# EAGLE design PCM2704_Test_v1 (EAGLE 6.4)
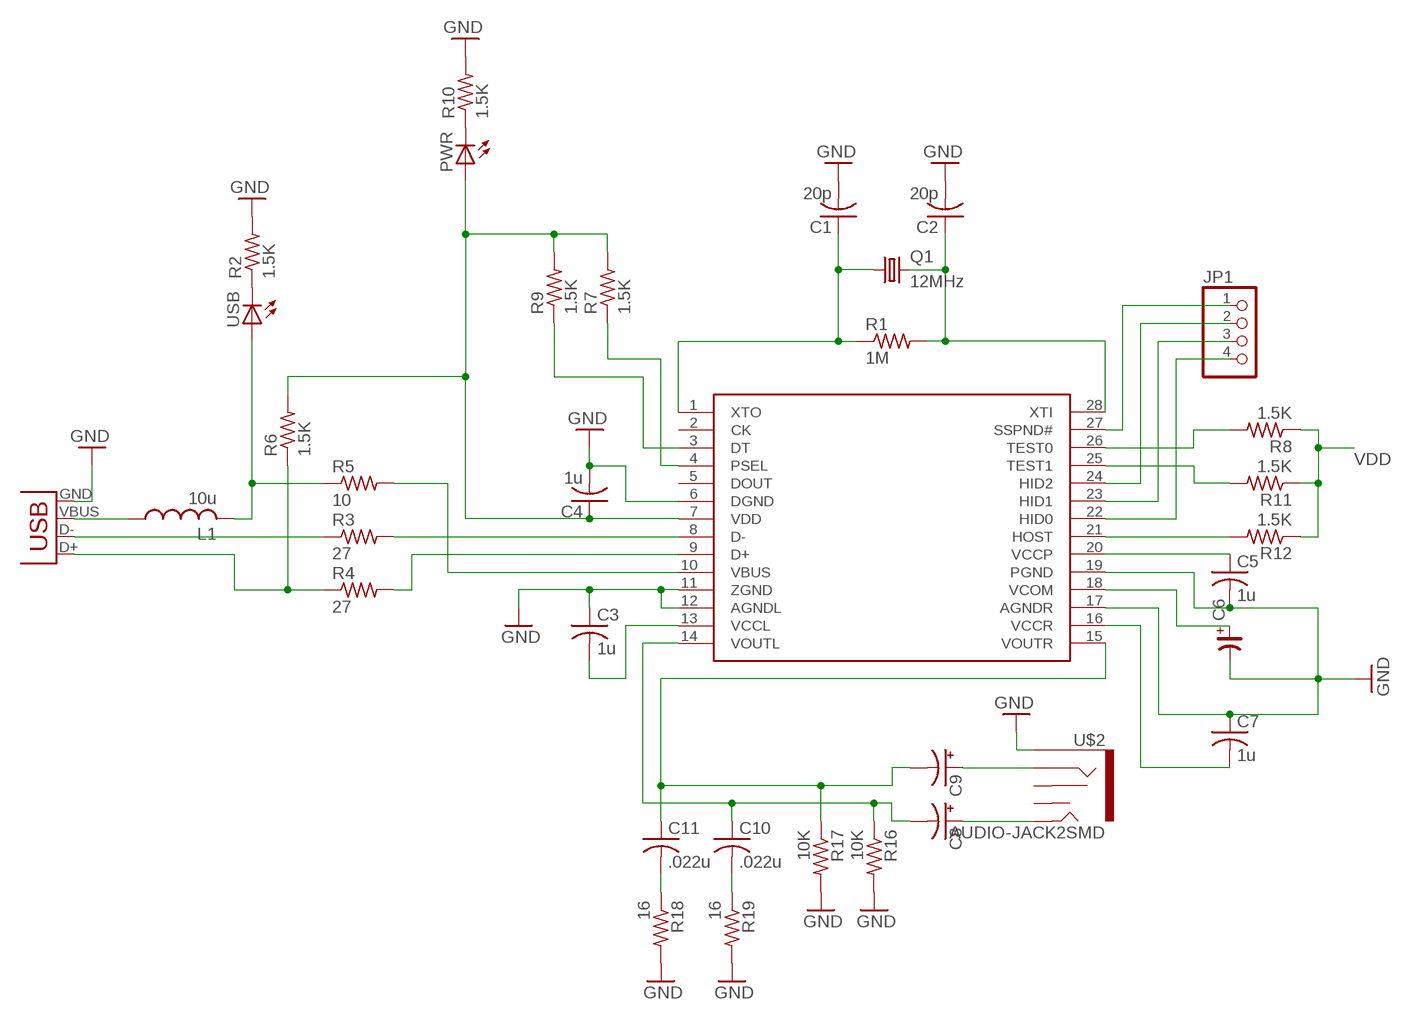
[diagram p0: schematic, sheet 1]

## Parts
C1  20p  C-USC0603  [C0603]
C2  20p  C-USC0603  [C0603]
C3  1u  C-USC0603  [C0603]
C4  1u  C-USC0603  [C0603]
C5  1u  C-USC0603  [C0603]
C6  CP_E-010X030  [CE-010X030]
C7  1u  C-USC0603  [C0603]
C8  CPOL-USE1.8-4  [E1,8-4]
C9  CPOL-USE1.8-4  [E1,8-4]
C10  .022u  C-USC0603  [C0603]
C11  .022u  C-USC0603  [C0603]
JP1  PINHD-1X4  [1X04]
L1  10u  L-USL3225M  [L3225M]
PWR  LEDCHIP-LED0603  [CHIP-LED0603]
Q1  12MHz  CRYSTALHC49US  [HC49US]
R1  1M  R-US_R0603  [R0603]
R2  1.5K  R-US_R0603  [R0603]
R3  27  R-US_R0603  [R0603]
R4  27  R-US_R0603  [R0603]
R5  10  R-US_R0603  [R0603]
R6  1.5K  R-US_R0603  [R0603]
R7  1.5K  R-US_R0603  [R0603]
R8  1.5K  R-US_R0603  [R0603]
R9  1.5K  R-US_R0603  [R0603]
R10  1.5K  R-US_R0603  [R0603]
R11  1.5K  R-US_R0603  [R0603]
R12  1.5K  R-US_R0603  [R0603]
R16  10K  R-US_R0603  [R0603]
R17  10K  R-US_R0603  [R0603]
R18  16  R-US_R0603  [R0603]
R19  16  R-US_R0603  [R0603]
U$1  PCM2704C  [PCM2704C]
U$2  AUDIO-JACK2SMD  [AUDIO-JACK-3.5MM-SMD]
USB  LEDCHIP-LED0603  [CHIP-LED0603]
X1  USB-MB-S  [USB-MB-S]

## Nets
GND: C1.2 C2.2 C3.1 C4.2 C5.2 C6.- C7.1 R2.2 R10.2 R16.2 R17.2 R18.2 R19.2 U$1.6(DGND) U$1.11(ZGND) U$1.12(AGNDL) U$1.17(AGNDR) U$1.19(PGND) U$2.SLEEVE X1.GND
N$1: C1.1 Q1.1 R1.1 U$1.1(XTO)
N$2: C2.1 Q1.2 R1.2 U$1.28(XTI)
N$3: R3.2 U$1.8(D-)
N$4: C3.2 U$1.13(VCCL)
N$5: R8.2 U$1.26(TEST0)
N$6: R4.2 U$1.9(D+)
N$7: L1.2 R5.1 USB.A
N$8: R5.2 U$1.10(VBUS)
N$9: R11.2 U$1.25(TEST1)
N$10: C9.- C11.1 R17.1 U$1.15(VOUTR)
N$11: R12.2 U$1.21(HOST)
N$12: JP1.1 U$1.27(SSPND#)
N$13: C5.1 U$1.20(VCCP)
N$14: C6.+ U$1.18(VCOM)
N$16: R9.1 U$1.3(DT)
N$17: R2.1 USB.C
N$18: C8.+ U$2.TIP
N$19: JP1.2 U$1.24(HID2)
N$20: JP1.3 U$1.23(HID1)
N$21: JP1.4 U$1.22(HID0)
N$22: PWR.C R10.1
N$23: C7.2 U$1.16(VCCR)
N$24: C8.- C10.1 R16.1 U$1.14(VOUTL)
N$25: C9.+ U$2.RING
N$27: C11.2 R18.1
N$28: C10.2 R19.1
PSEL: R7.1 U$1.4(PSEL)
USB_D_N: R3.1 X1.D-
USB_D_P: R4.1 R6.1 X1.D+
VBUS_RAW: L1.1 X1.VBUS
VDD: C4.1 PWR.A R6.2 R7.2 R8.1 R9.2 R11.1 R12.1 U$1.7(VDD)
Unconnected: U$1.2(CK) U$1.5(DOUT) U$2.RSH U$2.TSH

## Library data of the parts
C1-C5 C7 C10 C11 = rcl:C-US: CAPACITOR, American symbol
C6 = rc-master:CP_: POLARIZED CAP
C8 C9 = rcl:CPOL-US: POLARIZED CAPACITOR, American symbol
JP1 = pinhead:PINHD-1X4: PIN HEADER
L1 = rcl:L-US: INDUCTOR, American symbol
PWR USB = adafruit:LED: LED OSRAM: - CHIPLED LG R971, LG N971, LY N971, LG Q971, LY Q971, LO R971, LY R971 LH N974, LH R974 LS Q976, LO Q976, LY Q976 LO Q996 - Hyper CHIPLED LW Q18S LB Q993, LB Q99A, LB R99A - SideLED LS A670, LO A670, LY A670, LG A670, LP A670 LB A673, LV A673, LT A673, LW A673 LH A674 LY A675 LS A676, LA A676, LO A676, LY A676, LW A676 LS A679, LY A679, LG A679 - Hyper Micro SIDELED® LS Y876, LA Y876, LO Y876, LY Y876 LT Y87S - SmartLED LW L88C, LW L88S LB L89C, LB L89S, LG L890 LS L89K, LO L89K, LY L89K LS L896, LA L896, LO L896, LY L896 - TOPLED LS T670, LO T670, LY T670, LG T670, LP T670 LSG T670, LSP T670, LSY T670, LOP T670, LYG T670 LG T671, LOG T671, LSG T671 LB T673, LV T673, LT T673, LW T673 LH T674 LS T676, LA T676, LO T676, LY T676, LB T676, LH T676, LSB T676, LW T676 LB T67C, LV T67C, LT T67C, LS T67K, LO T67K, LY T67K, LW E67C LS E67B, LA E67B, LO E67B, LY E67B, LB E67C, LV E67C, LT E67C LW T67C LS T679, LY T679, LG T679 LS T770, LO T770, LY T770, LG T770, LP T770 LB T773, LV T773, LT T773, LW T773 LH T774 LS E675, LA E675, LY E675, LS T675 LS T776, LA T776, LO T776, LY T776, LB T776 LHGB T686 LT T68C, LB T68C - Hyper Mini TOPLED® LB M676 - Mini TOPLED Santana® LG M470 LS M47K, LO M47K, LY M47K Source: http://www.osram.convergy.de/
Q1 = SparkFun-FreqCtrl:CRYSTAL: Various standard crystals. Proven footprints. Spark Fun Electronics SKU : COM-00534
R1-R12 R16-R19 = rcl:R-US_: RESISTOR, American symbol
U$1 = pcm2704c:PCM2704C
U$2 = SparkFun-Connectors:AUDIO-JACK2: Stereo audio jack with bypass switches. Used on LilyPad MP3 board. Production SKU: CONN-10353; PROD_ID: CONN-10353
X1 = con-usb:USB: USB Connectors

## Board
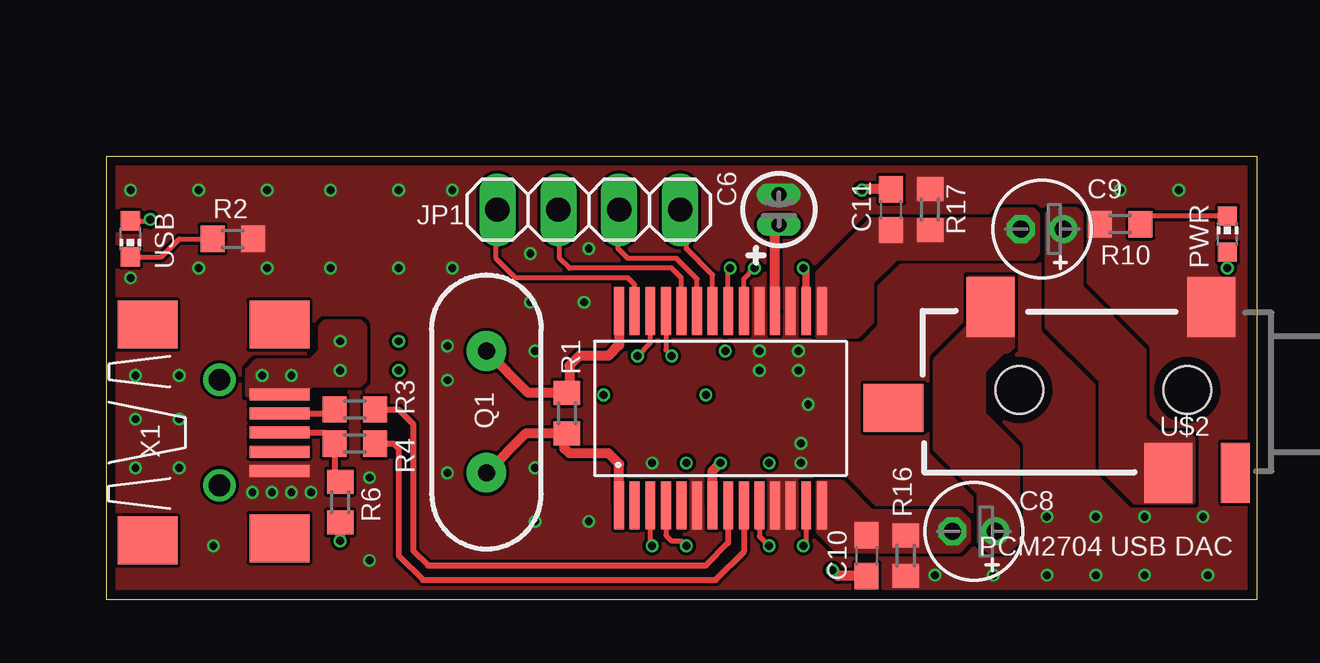
[diagram p1: board, top side]
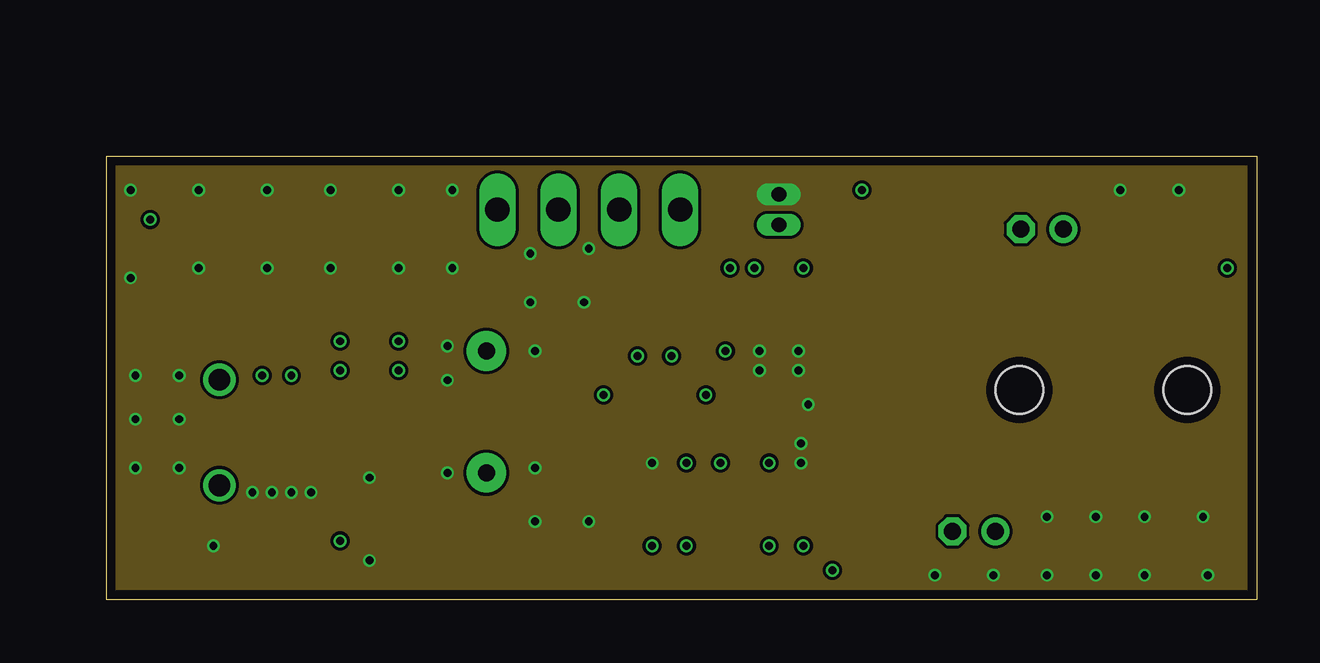
[diagram p2: board, inner layer Route2]
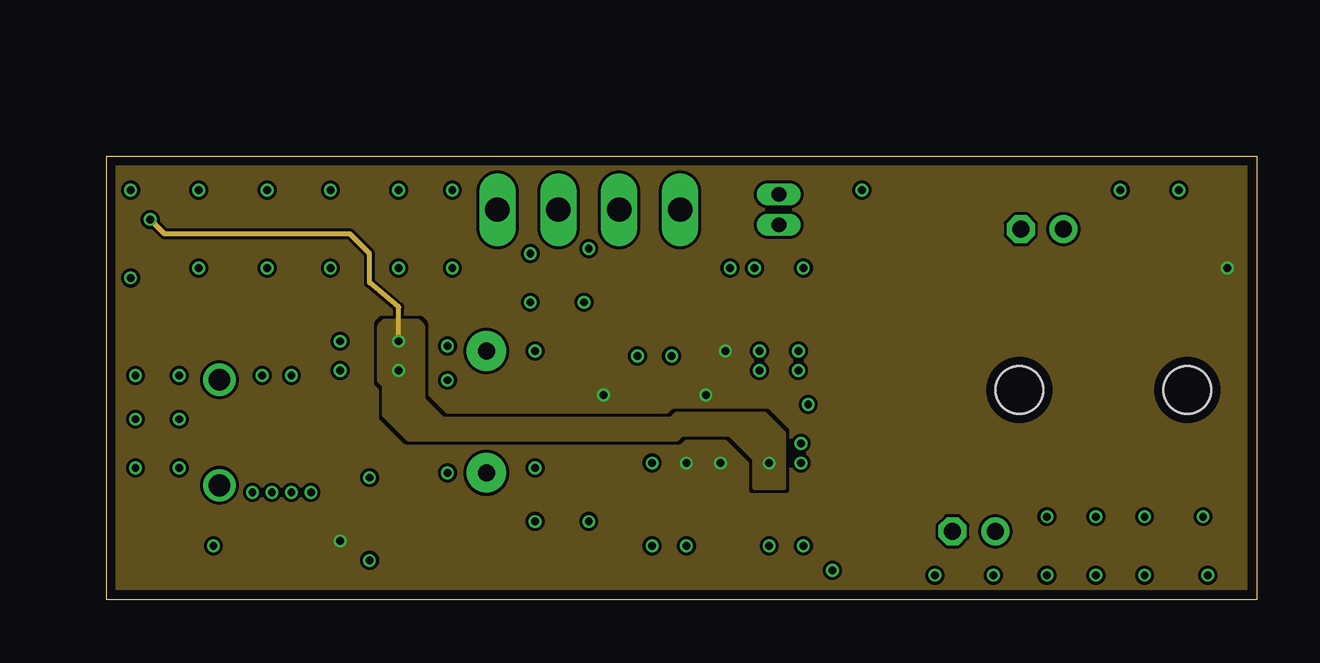
[diagram p3: board, inner layer Route3]
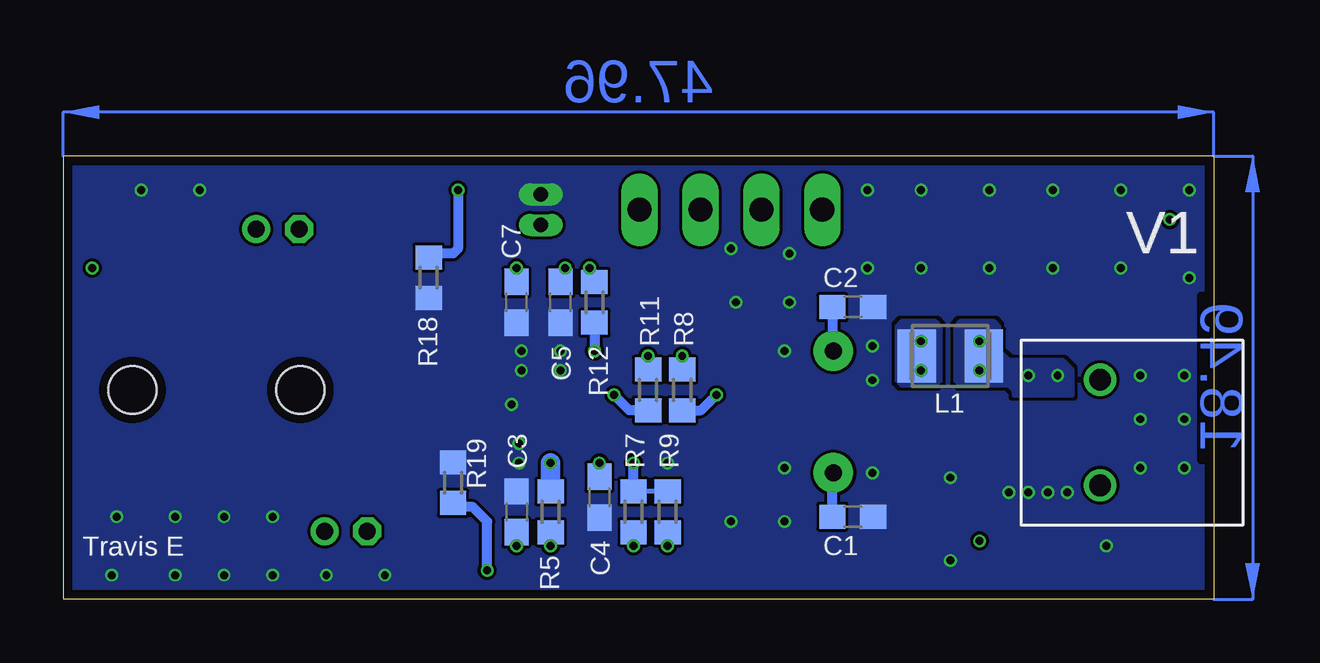
[diagram p4: board, bottom side, seen from below]

Size 47.96 x 18.49 mm. Coordinates in mm from the lower left corner, seen from the top.
Outline: 0,0 47.95,0 47.95,18.49 0,18.49 0,0
Copper layers (1*2+3*16): Top 0.035559375mm / dielectric 0.17018125mm / Route2 0.01778125mm / dielectric 47mil / Route3 0.0356mm / dielectric 0.2007mm / Bottom 0.035559375mm
Design rules "OSHPark-4layer *": minimum track width 5mil, minimum drill 10mil, track to track 5mil, track to pad 5mil, pad to pad 5mil, via to via 5mil, smd to smd 5mil, copper to edge 15mil, drill to drill 6mil, minimum pad ring 4mil, minimum via ring 4mil, stop-mask expansion 4mil, vias tented up to drill 14mil, thermal gap 10mil

### Footprints (pad centres in the part's own frame; a part is rotated, then mirrored left to right if it is on the bottom)
C0603 = smd 1.1 x 1: 1 -0.85,0; 2 0.85,0
CE-010X030 = drill 0.61 pad 0.813 long: + -0.635,0; - 0.635,0
E1,8-4 = drill 0.711 pad 1.168: + -0.889,0 | drill 0.711 pad 1.168 octagon: - 0.889,0
1X04 = drill 1.016 long: 1 -3.81,0; 2 -1.27,0; 3 1.27,0; 4 3.81,0
L3225M = smd 1.6 x 2.2: 1 -1.4,0; 2 1.4,0
CHIP-LED0603 = smd 0.8 x 0.8: A 0,-0.75; C 0,0.75
HC49US = drill 0.7 pad 1.651: 1 -2.54,0; 2 2.54,0
R0603 = smd 1 x 1.1: 1 -0.85,0; 2 0.85,0
PCM2704C = smd 0.41 x 2: 1 -4.225,-4.05; 2 -3.575,-4.05; 3 -2.925,-4.05; 4 -2.275,-4.05; 5 -1.625,-4.05; 6 -0.975,-4.05; 7 -0.325,-4.05; 8 0.325,-4.05; 9 0.975,-4.05; 10 1.625,-4.05; 11 2.275,-4.05; 12 2.925,-4.05; 13 3.575,-4.05; 14 4.225,-4.05; 15 4.225,4.05; 16 3.575,4.05; 17 2.925,4.05; 18 2.275,4.05; 19 1.625,4.05; 20 0.975,4.05; 21 0.325,4.05; 22 -0.325,4.05; 23 -0.975,4.05; 24 -1.625,4.05; 25 -2.275,4.05; 26 -2.925,4.05; 27 -3.575,4.05; 28 -4.225,4.05
AUDIO-JACK-3.5MM-SMD = smd 2 x 2.5: RING 4.3,3.45; SLEEVE 2.5,-3.45; TIP 11.7,-3.45 | smd 1.2 x 2.5: RSH 1.5,3.45 | smd 2.5 x 2: TSH 15.75,0.75 | hole 2: 3.5,0; 10.5,0
USB-MB-S = smd 2.5 x 0.5: D+ 2.5,0; D- 2.5,0.8; GND 2.5,-1.6; ID 2.5,-0.8; VBUS 2.5,1.6 | smd 2.5 x 2: P$1 -3,-4.5; P$2 -3,4.5; P$3 2.5,-4.4; P$4 2.5,4.5 | drill 0.9: P$5 0,2.2; P$6 0,-2.2

### Placement (x,y rotation side)
C1  15.04,3.45 0 bottom
C2  15.04,12.19 0 bottom
C3  29.06,3.66 270 bottom
C4  25.6,4.27 270 bottom
C5  27.23,12.4 270 bottom
C6  28.04,16.26 90 top
C7  29.06,12.4 90 bottom
C8  36.17,2.84 180 top
C9  39.01,15.44 180 top
C10  31.7,1.83 270 top
C11  32.72,16.26 90 top
JP1  20.12,16.26 0 top
L1  10.97,10.16 180 bottom
PWR  46.74,15.24 0 top
Q1  15.85,7.82 90 top
R1  19.2,7.77 90 top
R2  5.28,15.04 0 top
R3  10.36,7.92 0 top
R4  10.36,6.5 0 top
R5  27.64,3.66 270 bottom
R6  9.75,4.06 270 top
R7  24.18,3.66 90 bottom
R8  22.15,8.74 90 bottom
R9  22.76,3.66 90 bottom
R10  42.27,15.65 180 top
R11  23.57,8.74 90 bottom
R12  25.81,12.4 90 bottom
R16  33.32,1.83 270 top
R17  34.34,16.26 90 top
R18  32.72,13.41 270 bottom
R19  31.7,4.88 90 bottom
U$1  25.6,7.98 0 top
U$2  48.56,8.74 180 top
USB  1.02,15.04 180 top
X1  4.72,6.96 0 top

### Tracks (layer width: path | path; a pad name or v marks a point on that pad's centre or on a via)
GND  (via drill 0.33)
  other vias: 6.1,4.47 17.68,14.43 20.12,14.63 1.02,17.07 3.86,17.07 6.71,17.07 9.35,17.07 12.19,17.07 14.43,17.07 1.02,13.41 3.86,13.82 6.71,13.82 9.35,13.82 12.19,13.82 14.43,13.82 42.27,17.07 44.7,17.07 34.54,1.02 36.98,1.02 39.22,1.02 41.25,1.02 43.28,1.02 45.92,1.02 45.72,3.45 43.28,3.45 41.25,3.45 39.22,3.45 17.68,12.4 19.91,12.4 17.88,10.36 17.88,5.49 17.88,3.25 20.12,3.25 27.23,10.36 29.26,8.13 10.97,1.63 4.47,2.24 1.22,9.35 3.05,9.35 1.22,7.52 3.05,7.52 1.22,5.49 3.05,5.49 14.22,10.57 14.22,9.14 14.22,5.28 10.97,5.08 6.91,4.47 7.72,4.47 8.53,4.47 27.23,9.55 28.85,10.36 28.85,9.55 28.96,5.69 28.96,6.5 22.76,5.69
  pour Top (rank 6, no thermals): 0.2,18.29 47.75,18.29 47.75,0.2 0.2,0.2
  pour Bottom (rank 6, no thermals): 0.2,18.29 47.75,18.29 47.75,0.2 0.2,0.2
  pour Route2 (rank 6, no thermals): 0.2,18.29 47.75,18.29 47.75,0.2 0.2,0.2
N$1
  Top 0.406: U$1.1 21.38,5.65 20.93,6.1 19.3,6.1 19.1,6.3 19.1,6.82 R1.1 17.49,6.92 Q1.1
  Bottom 0.406: C1.1 15.89,5.25 Q1.1
N$2
  Top 0.406: U$1.28 21.38,10.61 20.93,10.16 19.71,10.16 19.3,9.75 19.3,8.72 R1.2 17.59,8.62 Q1.2
  Bottom 0.406: C2.1 15.89,10.4 Q1.2
N$3
  Top 0.254: R3.2 12.19,7.92 12.8,7.32 12.8,2.03 13.41,1.42 24.99,1.42 25.93,2.36 U$1.8
N$4  (via drill 0.33)
  Top 0.203: U$1.13 29.18,2.36 v29.06,2.23
  Bottom 0.203: C3.2 v29.06,2.23
N$5  (via drill 0.33)
  Top 0.203: U$1.26 22.68,10.69 v22.15,10.16
  Bottom 0.203: R8.2 v22.15,10.16
N$6
  Top 0.254: R4.2 11.99,6.5 12.19,6.3 12.19,1.83 13.21,0.81 25.4,0.81 26.58,1.99 U$1.9
N$7  (via drill 0.33)
  Top 0.203: USB.A 1.77,15.79 v1.83,15.85
  Route3 0.203: v12.19,10.77 12.19,12.19 10.97,13.21 10.97,14.43 10.16,15.24 2.44,15.24 v1.83,15.85
  Bottom 0.813: R5.1 v27.64,5.69
  other vias: 12.19,9.55
  pour Bottom (no thermals): 11.38,9.14 11.38,11.38 11.58,11.58 13,11.58 13.21,11.38 13.21,9.14 13,8.94 11.58,8.94
  pour Route3 (no thermals): 11.38,11.38 11.38,9.14 11.58,8.94 11.58,7.72 12.6,6.71 23.77,6.71 23.98,6.91 26.01,6.91 27.03,5.89 27.03,4.67 28.24,4.67 28.24,6.91 27.43,7.72 23.77,7.72 23.57,7.52 14.02,7.52 13.21,8.33 13.21,11.38 13,11.58 11.58,11.58
N$8  (via drill 0.33)
  Top 0.203: U$1.10 27.23,2.64 v27.64,2.23
  Bottom 0.203: R5.2 v27.64,2.23
N$9  (via drill 0.33)
  Top 0.203: U$1.25 23.33,10.4 v23.57,10.16
  Bottom 0.203: R11.2 v23.57,10.16
N$10
  pour Top (no thermals): 29.67,10.97 29.67,13.61 31.9,15.85 36.98,15.85 37.39,16.26 38.61,16.26 38.81,16.05 38.81,14.43 38.61,14.22 32.92,14.22 31.9,13.21 31.9,11.58 31.29,10.97
N$11  (via drill 0.33)
  Top 0.203: U$1.21 25.93,13.74 v26.01,13.82
  Bottom 0.203: R12.2 25.81,13.61 v26.01,13.82
N$12
  Top 0.203: U$1.27 22.03,13.12 21.74,13.41 17.07,13.41 16.26,14.22 16.26,16.2 JP1.1
N$13  (via drill 0.33)
  Top 0.203: U$1.20 26.58,13.37 v27.03,13.82
  Bottom 0.203: C5.1 27.23,13.61 v27.03,13.82
N$14
  Top 0.406: U$1.18 27.88,15.46 C6.+
N$16  (via drill 0.33)
  Top 0.203: U$1.3 22.68,2.31 v22.76,2.23
  Bottom 0.203: R9.1 v22.76,2.23
N$17
  Top 0.203: USB.C 2.3,14.29 3.05,15.04 R2.1
N$18
  pour Top (no thermals): 36.37,2.44 36.78,2.03 37.59,2.03 38,2.44 38,6.3 36.58,7.72 36.58,9.55 37.39,10.36 37.59,10.36 37.8,10.57 37.8,13.41 35.97,13.41 35.97,11.38 34.54,9.96 34.54,6.3 36.37,4.47
N$19
  Top 0.203: U$1.24 23.98,13.41 23.57,13.82 19.3,13.82 18.9,14.22 18.9,16.2 JP1.2
N$20
  Top 0.203: U$1.23 24.63,13.37 23.77,14.22 21.74,14.22 21.34,14.63 21.34,16.2 JP1.3
N$21
  Top 0.203: U$1.22 25.28,13.53 24.18,14.63 24.18,16 JP1.4
N$22
  Top 0.203: PWR.C 43.46,15.99 R10.1
N$23  (via drill 0.33)
  Top 0.305: U$1.16 29.18,13.7 v29.06,13.82
  Bottom 0.305: C7.2 v29.06,13.82
N$24
  pour Top (no thermals): 29.67,4.88 29.67,2.84 30.48,2.03 35.56,2.03 35.97,2.44 35.97,3.25 35.56,3.66 31.9,3.66 30.68,4.88
N$25
  pour Top (no thermals): 39.22,16.05 39.22,11.38 41.45,9.14 41.45,5.49 42.88,4.06 45.31,4.06 45.31,6.71 45.11,6.91 43.89,6.91 43.28,7.52 43.28,10.36 40.64,13 40.64,16.05 40.44,16.26 39.42,16.26
N$27  (via drill 0.33)
  Top 0.406: C11.2 31.53,17.11 v31.5,17.07
  Bottom 0.406: v31.5,17.07 31.5,14.63 31.7,14.43 32.55,14.43 R18.1
N$28  (via drill 0.33)
  Top 0.406: C10.2 30.52,0.98 v30.28,1.22
  Bottom 0.406: v30.28,1.22 30.28,3.25 30.89,3.86 31.53,3.86 R19.1
PSEL  (via drill 0.33)
  Top 0.203: U$1.4 23.33,2.68 23.57,2.44 23.98,2.44 v24.18,2.23
  Bottom 0.203: R7.1 v24.18,2.23
USB_D_N
  Top 0.254: X1.D- 9.35,7.76 R3.1
USB_D_P
  Top 0.254: X1.D+ 9.06,6.96 R4.1 9.51,5.15 R6.1
VBUS_RAW  (via drill 0.33)
  other vias: 6.5,9.35 7.72,9.35 9.75,9.55 9.75,10.77
  pour Top (no thermals): 5.89,8.53 5.89,9.55 6.3,9.96 8.53,9.96 8.94,10.36 8.94,11.38 9.14,11.58 10.57,11.58 10.77,11.38 10.77,9.14 10.57,8.94 8.53,8.94 8.33,8.74 8.33,8.53
  pour Bottom (no thermals): 5.89,8.53 5.89,9.55 6.3,9.96 8.53,9.96 8.94,10.36 8.94,11.38 9.14,11.58 10.57,11.58 10.77,11.38 10.77,9.14 10.57,8.94 8.53,8.94 8.33,8.74 8.33,8.53
VDD  (via drill 0.33)
  Top 0.203: v46.74,13.82 PWR.A
  Top 0.406: U$1.7 25.28,5.37 v25.6,5.69 | R6.2 v9.75,2.44
  Bottom 0.203: C4.1 v25.6,5.69 | R9.2 R7.2
  Bottom 0.406: R8.1 21.37,7.89 v20.73,8.53 | R11.1 24.35,7.89 v24.99,8.53 | R12.1 v25.81,10.36 | R7.2 v24.18,5.69
  pour Route3 (rank 6, no thermals): 0.2,18.29 47.75,18.29 47.75,0.2 0.2,0.2
(copper drawn outside any net)
  shapes: Bottom area x2

### Text on the board
tPlace: PCM2704 USB DAC
bPlace: V1 | Travis E